# EAGLE schematic Nixie Clock v2 (EAGLE 9.6.2)
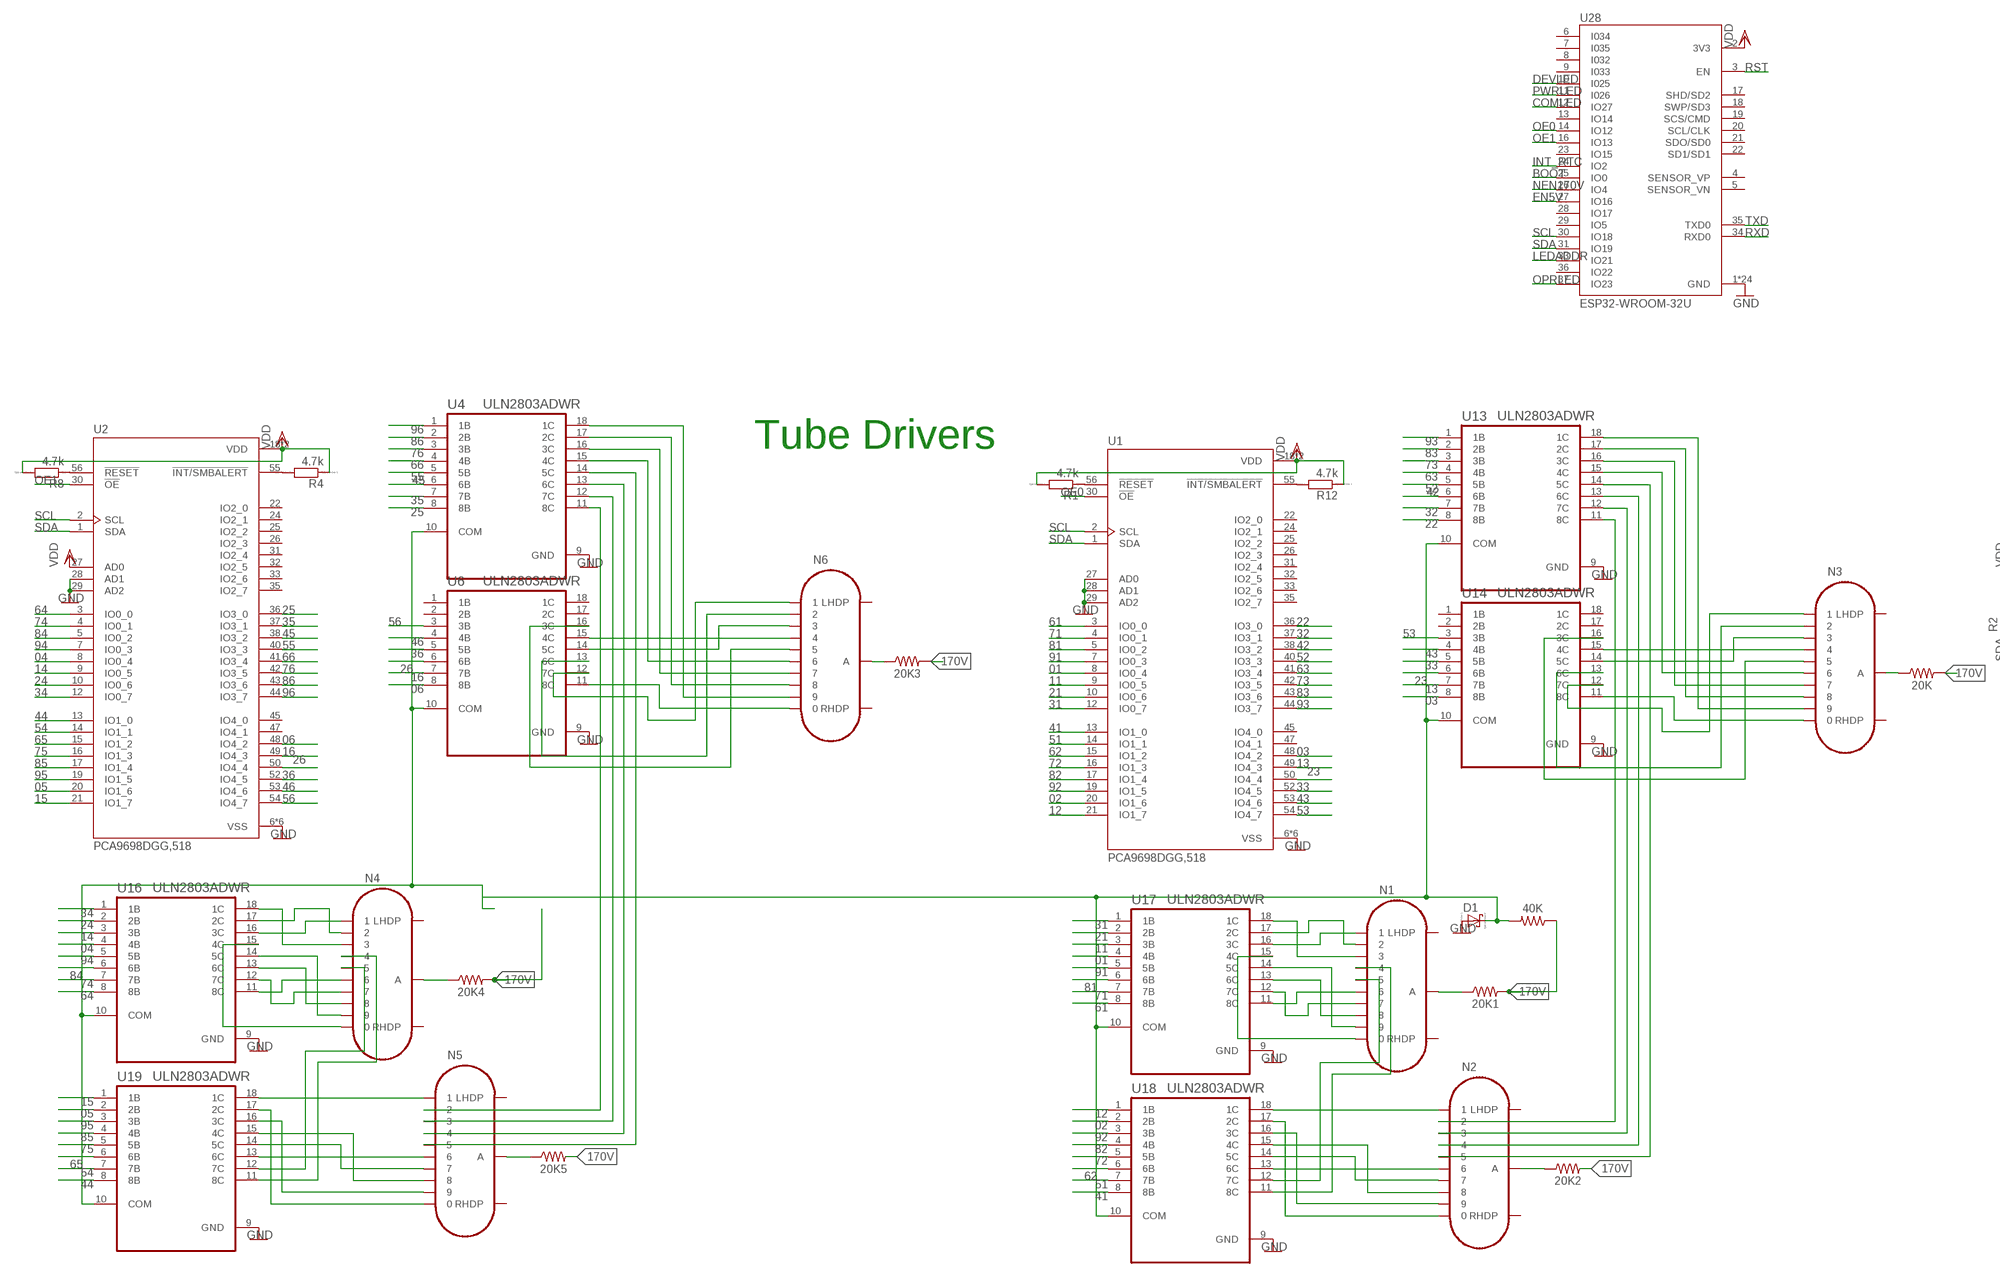
[diagram p0: schematic, sheet 1, part 1 of 2]
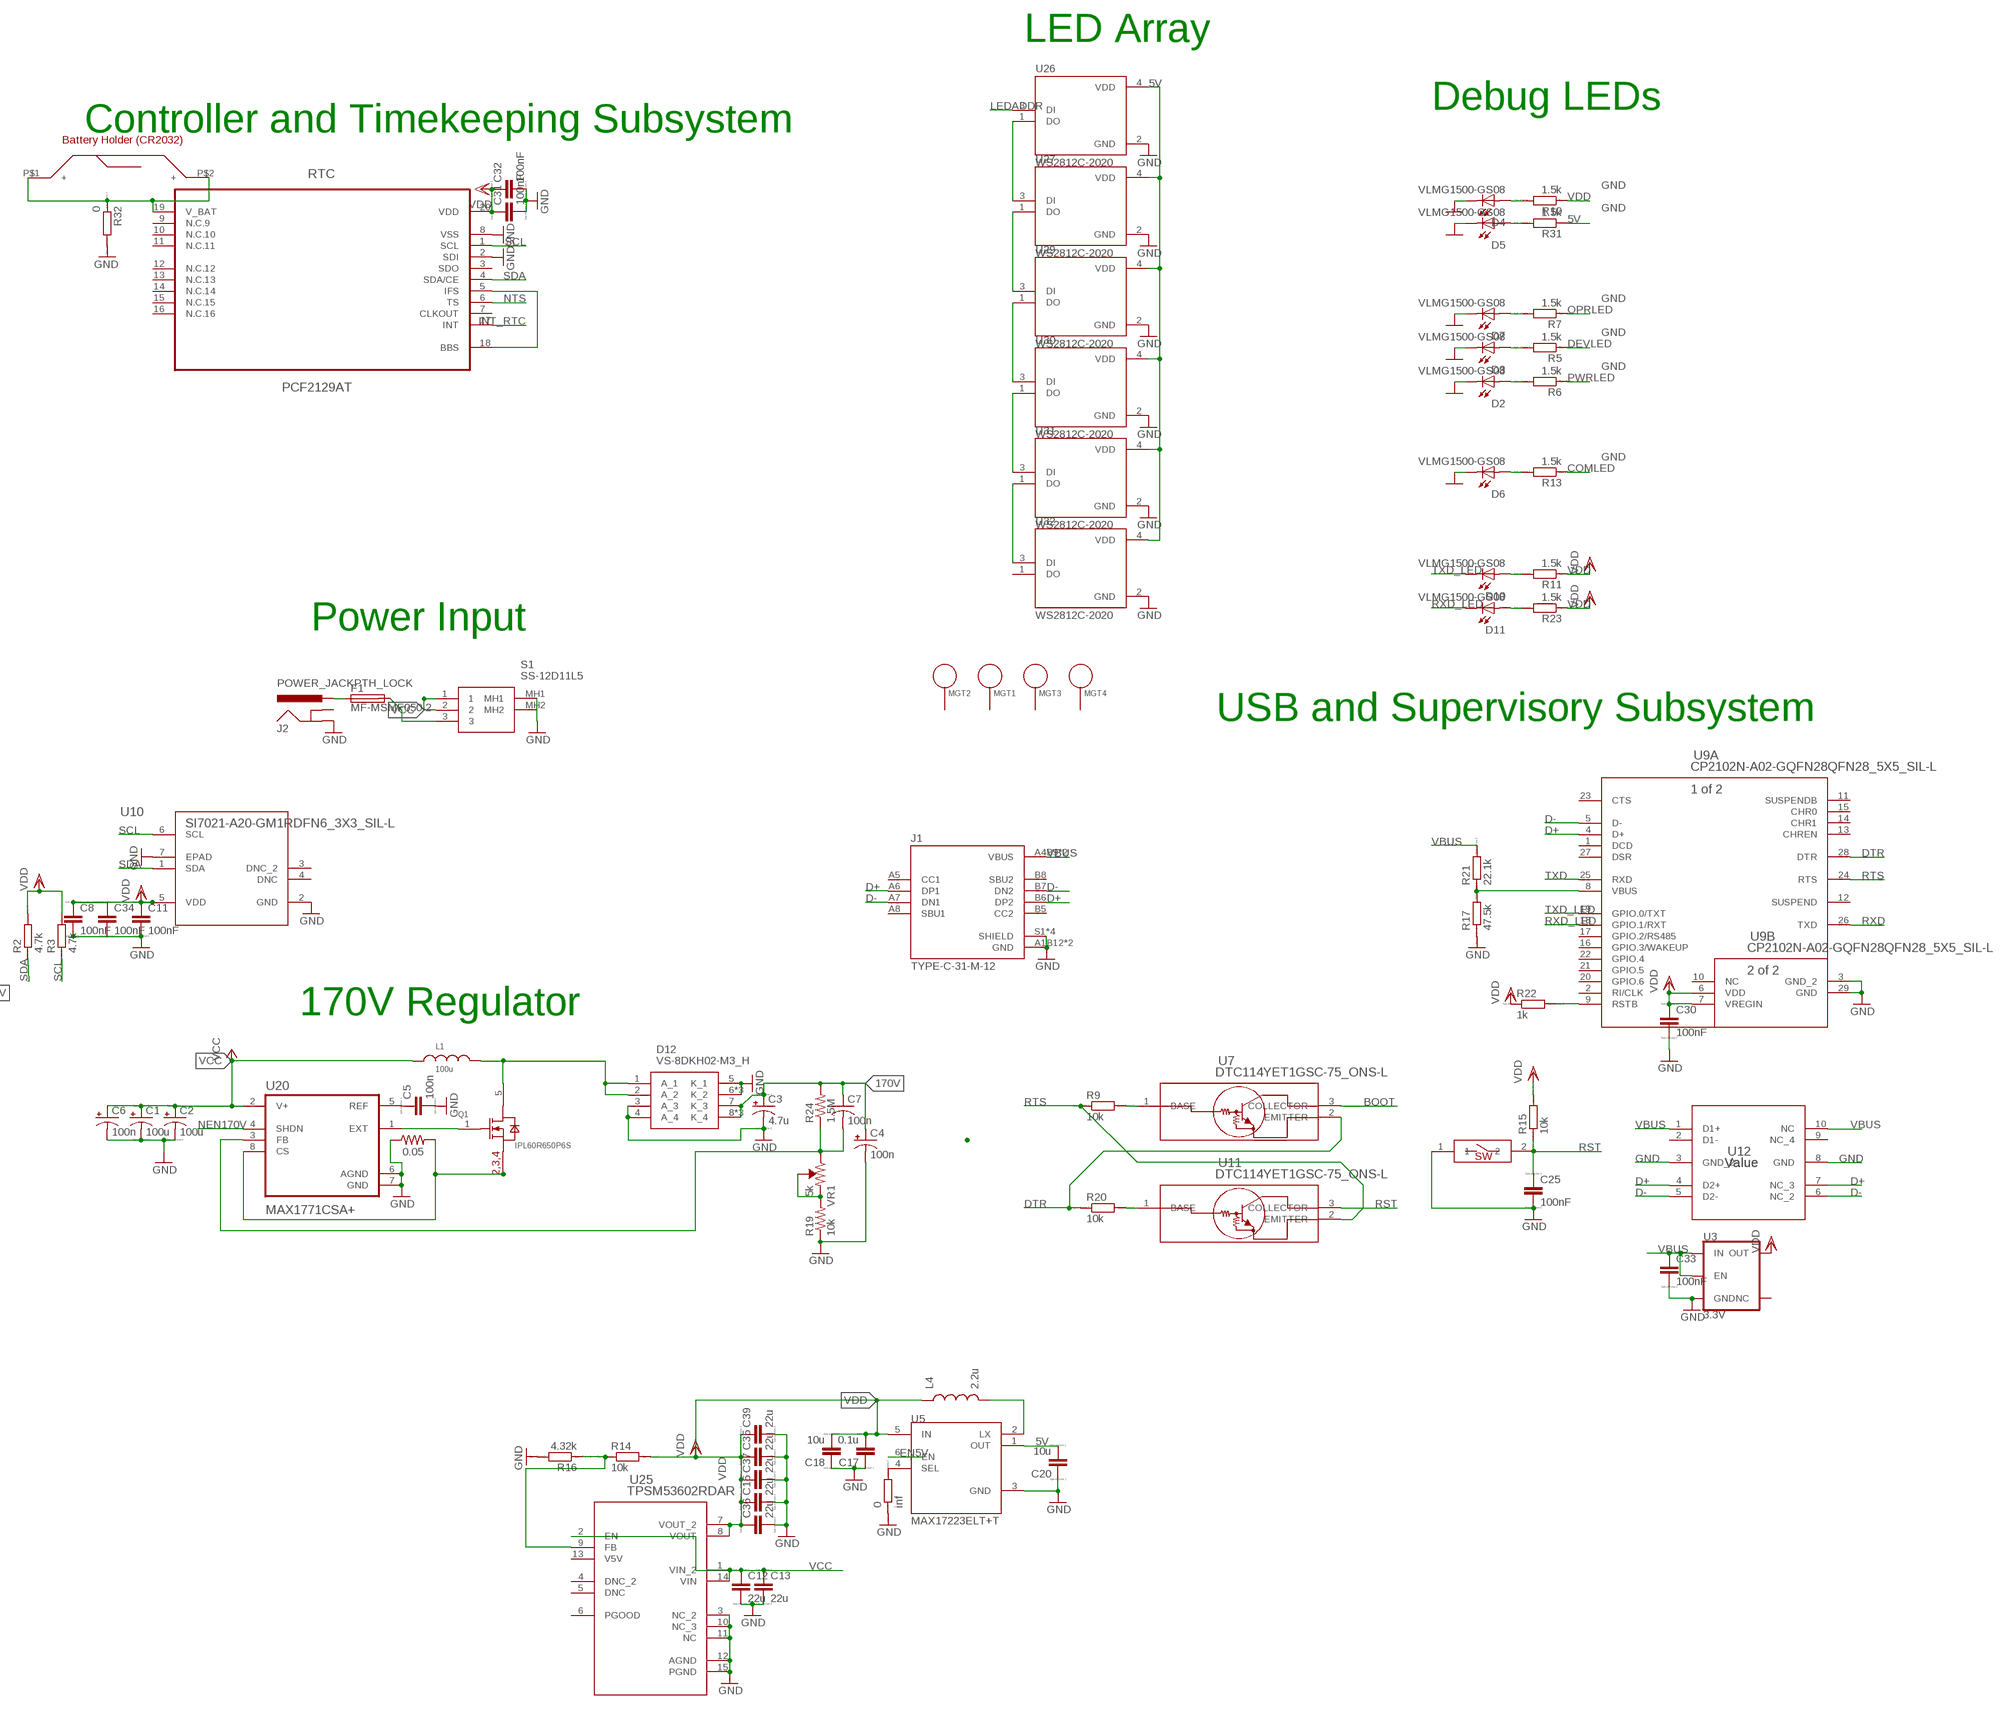
[diagram p1: schematic, sheet 1, part 2 of 2]

## Parts
0  inf  RR0402  [R0402]
0.05  0.05  0.1OHM-1210-1/2W-1%  [1210]
20K  0.05  0.1OHM-1210-1/2W-1%  [1210]
20K1  0.05  0.1OHM-1210-1/2W-1%  [1210]
20K2  0.05  0.1OHM-1210-1/2W-1%  [1210]
20K3  0.05  0.1OHM-1210-1/2W-1%  [1210]
20K4  0.05  0.1OHM-1210-1/2W-1%  [1210]
20K5  0.05  0.1OHM-1210-1/2W-1%  [1210]
40K  0.05  0.1OHM-1210-1/2W-1%  [1210]
C1  100u  CPOL-USE3.5-8  [E3,5-8]
C2  100u  CPOL-USE3.5-8  [E3,5-8]
C3  4.7u  CPOL-USE3.5-8  [E3,5-8]
C4  100n  CAPACITOR-PA/3216-18W  [A/3216-18W]
C5  100n  CC0402  [C0402]
C6  100n  CAPACITOR-PA/3216-18W  [A/3216-18W]
C7  100n  C-USC1206K  [C1206K]
C8  100nF  CC0402  [C0402]
C11  100nF  CC0402  [C0402]
C12  22u  CC0603R  [C0603R]
C13  22u  CC0603R  [C0603R]
C15  22u  CC0603R  [C0603R]
C17  0.1u  CC0402  [C0402]
C18  10u  CC0402  [C0402]
C20  10u  CC0402  [C0402]
C25  100nF  CC0402  [C0402]
C30  100nF  CC0402  [C0402]
C31  100nF  CC0402  [C0402]
C32  100nF  CC0402  [C0402]
C33  100nF  CC0402  [C0402]
C34  100nF  CC0402  [C0402]
C35  22u  CC0603R  [C0603R]
C36  22u  CC0603R  [C0603R]
C37  22u  CC0603R  [C0603R]
C39  22u  CC0603R  [C0603R]
D1  SCHOTTKY-DIODE  [DIODE_SMB]
D2  VLMG1500-GS08  [LEDC1005X35N]
D3  VLMG1500-GS08  [LEDC1005X35N]
D4  VLMG1500-GS08  [LEDC1005X35N]
D5  VLMG1500-GS08  [LEDC1005X35N]
D6  VLMG1500-GS08  [LEDC1005X35N]
D7  VLMG1500-GS08  [LEDC1005X35N]
D10  VLMG1500-GS08  [LEDC1005X35N]
D11  VLMG1500-GS08  [LEDC1005X35N]
D12  VS-8DKH02-M3_H  [VS8DKH02M3H]
F1  MF-MSMF050-2  [1812]
J1  TYPE-C-31-M-12  [HRO_TYPE-C-31-M-12]
J2  POWER_JACKPTH_LOCK  [POWER_JACK_PTH_LOCK]
L1  100u  WE-PD_1210_7447709001  [WE-PD_1260/1245/1280/1210]
L4  2.2u  INDUCTOR  [L0603]
MGT1  BEAGLEBONEBLACK_MOUNTING_HOLE  [BEAGLEBONEBLACK_MOUNTING_HOLE]
MGT2  BEAGLEBONEBLACK_MOUNTING_HOLE  [BEAGLEBONEBLACK_MOUNTING_HOLE]
MGT3  BEAGLEBONEBLACK_MOUNTING_HOLE  [BEAGLEBONEBLACK_MOUNTING_HOLE]
MGT4  BEAGLEBONEBLACK_MOUNTING_HOLE  [BEAGLEBONEBLACK_MOUNTING_HOLE]
N1  IN-14  [IN-14]
N2  IN-14  [IN-14]
N3  IN-14  [IN-14]
N4  IN-14  [IN-14]
N5  IN-14  [IN-14]
N6  IN-14  [IN-14]
Q1  IPL60R650P6S  [INF-PG-TSON-8-2]
R1  4.7k  RR0402  [R0402]
R2  4.7k  RR0402  [R0402]
R3  4.7k  RR0402  [R0402]
R4  4.7k  RR0402  [R0402]
R5  1.5k  RR0402  [R0402]
R6  1.5k  RR0402  [R0402]
R7  1.5k  RR0402  [R0402]
R8  4.7k  RR0402  [R0402]
R9  10k  RR0402  [R0402]
R10  1.5k  RR0402  [R0402]
R11  1.5k  RR0402  [R0402]
R12  4.7k  RR0402  [R0402]
R13  1.5k  RR0402  [R0402]
R14  10k  RR0402  [R0402]
R15  10k  RR0402  [R0402]
R16  4.32k  RR0402  [R0402]
R17  47.5k  RR0402  [R0402]
R19  10k  R-US_M1206  [M1206]
R20  10k  RR0402  [R0402]
R21  22.1k  RR0402  [R0402]
R22  1k  RR0402  [R0402]
R23  1.5k  RR0402  [R0402]
R24  1.5M  R-US_M1206  [M1206]
R31  1.5k  RR0402  [R0402]
R32  0  RR0402  [R0402]
RESET  SMDSWITCH  [RESC4217X170]
S1  SS-12D11L5  [SS12D11L5]
U1  PCA9698DGG,518  [SOP50P810X120-56N]
U2  PCA9698DGG,518  [SOP50P810X120-56N]
U3  3.3V  V_REG_AP2112K-3.3V  [SOT23-5]
U4  ULN2803ADWR  [SOIC127P1030X265-18N]
U5  MAX17223ELT+T  [PSON65P200X200X80-6N]
U6  ULN2803ADWR  [SOIC127P1030X265-18N]
U7  DTC114YET1GSC-75_ONS-L  [SC-75_ONS-L]
U9  CP2102N-A02-GQFN28QFN28_5X5_SIL-L  [QFN28_5X5_SIL-L]
U10  SI7021-A20-GM1RDFN6_3X3_SIL-L  [DFN6_3X3_SIL-L]
U11  DTC114YET1GSC-75_ONS-L  [SC-75_ONS-L]
U12  Value  ESD204DQAR  [DQA0010A]
U13  ULN2803ADWR  [SOIC127P1030X265-18N]
U14  ULN2803ADWR  [SOIC127P1030X265-18N]
U16  ULN2803ADWR  [SOIC127P1030X265-18N]
U17  ULN2803ADWR  [SOIC127P1030X265-18N]
U18  ULN2803ADWR  [SOIC127P1030X265-18N]
U19  ULN2803ADWR  [SOIC127P1030X265-18N]
U20  MAX1771CSA+  [SOIC127P600X175-8N]
U25  TPSM53602RDAR  [B3QFN15_RDA_TEX]
U26  WS2812C-2020  [LED_WS2812C-2020]
U27  WS2812C-2020  [LED_WS2812C-2020]
U28  ESP32-WROOM-32U  [XCVR_ESP32-WROOM-32U]
U29  WS2812C-2020  [LED_WS2812C-2020]
U30  WS2812C-2020  [LED_WS2812C-2020]
U31  WS2812C-2020  [LED_WS2812C-2020]
U32  WS2812C-2020  [LED_WS2812C-2020]
U$1  PCF2129AT  [PCF2129AT]
U$2  HOLDER  [HOLDER]
VR1  5k  TRIMPOT-SMD-3MM-CLOSED-1/8W-20%  [TRIMPOT-SMD-3MM-CLOSED]

## Nets
01: U1.8(IO0_4) U17.4(4B)
02: U1.20(IO1_6) U18.2(2B)
03: U1.48(IO4_2) U14.8(8B)
04: U2.8(IO0_4) U16.4(4B)
05: U2.20(IO1_6) U19.2(2B)
5V: C20.2 R31.1 U5.1(OUT) U26.4(VDD) U27.4(VDD) U29.4(VDD) U30.4(VDD) U31.4(VDD) U32.4(VDD)
06: U2.48(IO4_2) U6.8(8B)
11: U1.9(IO0_5) U17.3(3B)
12: U1.21(IO1_7) U18.1(1B)
13: U1.49(IO4_3) U14.7(7B)
14: U2.9(IO0_5) U16.3(3B)
15: U2.21(IO1_7) U19.1(1B)
16: U2.49(IO4_3) U6.7(7B)
21: U1.10(IO0_6) U17.2(2B)
22: U1.36(IO3_0) U13.8(8B)
23: U1.50(IO4_4) U14.6(6B)
24: U2.10(IO0_6) U16.2(2B)
25: U2.36(IO3_0) U4.8(8B)
26: U2.50(IO4_4) U6.6(6B)
31: U1.12(IO0_7) U17.1(1B)
32: U1.37(IO3_1) U13.7(7B)
33: U1.52(IO4_5) U14.5(5B)
34: U2.12(IO0_7) U16.1(1B)
35: U2.37(IO3_1) U4.7(7B)
36: U2.52(IO4_5) U6.5(5B)
41: U1.13(IO1_0) U18.8(8B)
42: U1.38(IO3_2) U13.6(6B)
43: U1.53(IO4_6) U14.4(4B)
44: U2.13(IO1_0) U19.8(8B)
45: U2.38(IO3_2) U4.6(6B)
46: U2.53(IO4_6) U6.4(4B)
51: U1.14(IO1_1) U18.7(7B)
52: U1.40(IO3_3) U13.5(5B)
53: U1.54(IO4_7) U14.3(3B)
54: U2.14(IO1_1) U19.7(7B)
55: U2.40(IO3_3) U4.5(5B)
56: U2.54(IO4_7) U6.3(3B)
61: U1.3(IO0_0) U17.8(8B)
62: U1.15(IO1_2) U18.6(6B)
63: U1.41(IO3_4) U13.4(4B)
64: U2.3(IO0_0) U16.8(8B)
65: U2.15(IO1_2) U19.6(6B)
66: U2.41(IO3_4) U4.4(4B)
71: U1.4(IO0_1) U17.7(7B)
72: U1.16(IO1_3) U18.5(5B)
73: U1.42(IO3_5) U13.3(3B)
74: U2.4(IO0_1) U16.7(7B)
75: U2.16(IO1_3) U19.5(5B)
76: U2.42(IO3_5) U4.3(3B)
81: U1.5(IO0_2) U17.6(6B)
82: U1.17(IO1_4) U18.4(4B)
83: U1.43(IO3_6) U13.2(2B)
84: U2.5(IO0_2) U16.6(6B)
85: U2.17(IO1_4) U19.4(4B)
86: U2.43(IO3_6) U4.2(2B)
91: U1.7(IO0_3) U17.5(5B)
92: U1.19(IO1_5) U18.3(3B)
93: U1.44(IO3_7) U13.1(1B)
94: U2.7(IO0_3) U16.5(5B)
95: U2.19(IO1_5) U19.3(3B)
96: U2.44(IO3_7) U4.1(1B)
170V [HV]: 20K1.2 20K2.2 20K3.2 20K4.2 20K5.2 20K.2 40K.1 C3.+ C4.+ C7.1 D12.7(K_3) D12.8(K_4) D12.9(K_4) D12.12(K_4) R24.2
BOOT: U7.3(COLLECTOR) U28.25(IO0)
COMLED: R13.1 U28.12(IO27)
D+: J1.A6(DP1) J1.B6(DP2) U9.4(A:D+) U12.4(D2+) U12.7(NC_3)
D-: J1.A7(DN1) J1.B7(DN2) U9.5(A:D-) U12.5(D2-) U12.6(NC_2)
DEVLED: R5.1 U28.10(I025)
DTR: R20.1 U7.2(EMITTER) U9.28(A:DTR)
EN5V: U5.6(EN) U28.27(IO16)
GND: 0.1 0.05.1 C1.- C2.- C3.- C4.- C5.2 C6.- C8.2 C11.2 C12.2 C13.2 C15.2 C17.1 C18.1 C20.1 C25.2 C30.2 C31.2 C32.2 C33.2 C34.2 C35.2 C36.2 C37.2 C39.2 D1.A(C) D2.2 D3.2 D4.2 D5.2 D6.2 D7.2 D12.3(A_3) D12.4(A_4) D12.5(K_1) D12.6(K_2) D12.10(K_2) D12.11(K_2) J1.A1B12(GND) J1.B1A12(GND) J1.S1(SHIELD) J1.S2(SHIELD) J1.S3(SHIELD) J1.S4(SHIELD) J2.GND R16.2 R17.1 R19.1 R32.2 RESET.1 S1.MH1 S1.MH2 U1.6(VSS) U1.11(VSS) U1.23(VSS) U1.27(AD0) U1.28(AD1) U1.29(AD2) U1.34(VSS) U1.39(VSS) U1.51(VSS) U2.6(VSS) U2.11(VSS) U2.23(VSS) U2.28(AD1) U2.29(AD2) U2.34(VSS) U2.39(VSS) U2.51(VSS) U3.2(GND) U4.9(GND) U5.3(GND) U6.9(GND) U9.3(B:GND_2) U9.29(B:GND) U10.2(GND) U10.7(EPAD) U12.3(GND_2) U12.8(GND) U13.9(GND) U14.9(GND) U16.9(GND) U17.9(GND) U18.9(GND) U19.9(GND) U20.6(AGND) U20.7(GND) U25.3(NC_2) U25.10(NC_3) U25.11(NC) U25.12(AGND) U25.15(PGND) U26.2(GND) U27.2(GND) U28.1(GND) U28.15(GND) U28.38(GND) U28.G.1(GND) U28.G.2(GND) U28.G.4(GND) U28.G.5(GND) U28.G.6(GND) U28.G.7(GND) U28.G.8(GND) U28.G.9(GND) U28.G.10(GND) U28.G.11(GND) U28.G.12(GND) U28.G.13(GND) U28.G.14(GND) U28.G.15(GND) U28.G.16(GND) U28.G.17(GND) U28.G.18(GND) U28.G.19(GND) U28.G.20(GND) U28.G.21(GND) U28.G.22(GND) U29.2(GND) U30.2(GND) U31.2(GND) U32.2(GND) U$1.2(SDI) U$1.8(VSS)
INT_RTC: U28.24(IO2) U$1.17(INT)
LEDADDR: U26.3(DI) U28.33(IO21)
N$1: F1.1 J2.PWR
N$2: C5.1 U20.5(REF)
N$3: 20K1.1 N1.A
N$4: Q1.1(GATE) U20.1(EXT)
N$5: 0.05.2 Q1.2(SOURCE) Q1.3(SOURCE) Q1.4(SOURCE) U20.8(CS)
N$6: D12.1(A_1) D12.2(A_2) L1.2 Q1.5(DRAIN)
N$7 [HV]: N2.0 U18.17(2C)
N$8 [HV]: N2.9 U18.16(3C)
N$9: 20K2.1 N2.A
N$10: R19.2 VR1.1(CCW) VR1.2(WIPER)
N$11: C7.2 R24.1 U20.3(FB) VR1.3(CW)
N$12 [HV]: N2.8 U18.15(4C)
N$13 [HV]: N2.7 U18.14(5C)
N$14 [HV]: N1.5 U18.12(7C)
N$15: 20K.1 N3.A
N$16 [HV]: N2.6 U18.13(6C)
N$17: 0.2 U5.4(SEL)
N$18: D3.1 R5.2
N$19: D7.1 R7.2
N$20: L4.2 U5.2(LX)
N$21: 20K4.1 N4.A
N$22 [HV]: N2.1 U18.18(1C)
N$23: R17.2 R21.1 U9.8(A:VBUS)
N$24: D2.1 R6.2
N$25: D4.1 R10.2
N$26: D5.1 R31.2
N$27: D6.1 R13.2
N$28 [HV]: N2.2 U13.11(8C)
N$29: R20.2 U11.1(BASE)
N$30: R9.2 U7.1(BASE)
N$32 [HV]: N1.6 U17.11(8C)
N$33 [HV]: N1.7 U17.12(7C)
N$35: R22.2 U9.9(A:RSTB)
N$36: D10.1 R11.2
N$37: D11.1 R23.2
N$38: F1.2 S1.3
N$39 [HV]: N1.8 U17.13(6C)
N$40 [HV]: N1.9 U17.14(5C)
N$41 [HV]: N1.0 U17.15(4C)
N$42 [HV]: N1.1 U17.16(3C)
N$43 [HV]: N1.2 U17.17(2C)
N$44 [HV]: N1.3 U17.18(1C)
N$45 [HV]: N2.3 U13.12(7C)
N$46 [HV]: N1.4 U18.11(8C)
N$47 [HV]: N2.4 U13.13(6C)
N$48 [HV]: N2.5 U13.14(5C)
N$49 [HV]: N3.6 U13.15(4C)
N$50 [HV]: N3.7 U13.16(3C)
N$51 [HV]: N3.8 U13.17(2C)
N$52 [HV]: N3.9 U13.18(1C)
N$53 [HV]: N3.0 U14.11(8C)
N$54 [HV]: N3.1 U14.12(7C)
N$55 [HV]: N3.2 U14.13(6C)
N$56 [HV]: N3.3 U14.14(5C)
N$57 [HV]: N3.4 U14.15(4C)
N$58 [HV]: N3.5 U14.16(3C)
N$59: R4.2 U2.55(!INT/SMBALERT)
N$60 [HV]: N4.6 U16.11(8C)
N$61 [HV]: N4.7 U16.12(7C)
N$62 [HV]: N4.8 U16.13(6C)
N$63 [HV]: N4.9 U16.14(5C)
N$64 [HV]: N4.0 U16.15(4C)
N$65 [HV]: N4.1 U16.16(3C)
N$66 [HV]: N4.2 U16.17(2C)
N$67 [HV]: 40K.2 D1.C(A) U4.10(COM) U6.10(COM) U13.10(COM) U14.10(COM) U16.10(COM) U17.10(COM) U18.10(COM) U19.10(COM)
N$68 [HV]: N4.3 U16.18(1C)
N$69 [HV]: N4.4 U19.11(8C)
N$70 [HV]: N4.5 U19.12(7C)
N$71 [HV]: N5.0 U19.17(2C)
N$72 [HV]: N5.9 U19.16(3C)
N$73 [HV]: N5.8 U19.15(4C)
N$74 [HV]: N5.7 U19.14(5C)
N$75 [HV]: N5.6 U19.13(6C)
N$76 [HV]: N5.1 U19.18(1C)
N$77 [HV]: N5.2 U4.11(8C)
N$78 [HV]: N5.3 U4.12(7C)
N$79 [HV]: N5.4 U4.13(6C)
N$80 [HV]: N5.5 U4.14(5C)
N$81 [HV]: N6.6 U4.15(4C)
N$82 [HV]: N6.7 U4.16(3C)
N$83 [HV]: N6.8 U4.17(2C)
N$84 [HV]: N6.9 U4.18(1C)
N$85 [HV]: N6.0 U6.11(8C)
N$86 [HV]: N6.1 U6.12(7C)
N$87 [HV]: N6.2 U6.13(6C)
N$88 [HV]: N6.3 U6.14(5C)
N$89 [HV]: N6.4 U6.15(4C)
N$90 [HV]: N6.5 U6.16(3C)
N$91: R14.1 R16.1 U25.9(FB)
N$92: 20K5.1 N5.A
N$93: 20K3.1 N6.A
N$94: R1.1 U1.56(!RESET)
N$95: R12.2 U1.55(!INT/SMBALERT)
N$96: R32.1 U$1.19(V_BAT) U$2.P$1(+) U$2.P$2(+)
N$97: R8.1 U2.56(!RESET)
N$100: U26.1(DO) U27.3(DI)
N$101: U27.1(DO) U29.3(DI)
N$102: U29.1(DO) U30.3(DI)
N$103: U30.1(DO) U31.3(DI)
N$104: U31.1(DO) U32.3(DI)
N$199: U$1.5(IFS) U$1.18(BBS)
NEN170V: U20.4(SHDN) U28.26(IO4)
NTS: U$1.6(TS)
OE0: U1.30(!OE) U28.14(IO12)
OE1: U2.30(!OE) U28.16(IO13)
OPRLED: R7.1 U28.37(IO23)
PWRLED: R6.1 U28.11(I026)
RST: C25.1 R15.1 RESET.2 U11.3(COLLECTOR) U28.3(EN)
RTS: R9.1 U9.24(A:RTS) U11.2(EMITTER)
RXD: U9.26(A:TXD) U28.34(RXD0)
RXD_LED: D11.2 U9.18(A:GPIO.1/RXT)
SCL: R3.1 U1.2(SCL) U2.2(SCL) U10.6(SCL) U28.30(IO18) U$1.1(SCL)
SDA: R2.1 U1.1(SDA) U2.1(SDA) U10.1(SDA) U28.31(IO19) U$1.4(SDA/CE)
TXD: U9.25(A:RXD) U28.35(TXD0)
TXD_LED: D10.2 U9.19(A:GPIO.0/TXT)
VBUS: C33.1 J1.A4B9(VBUS) J1.B4A9(VBUS) R21.2 U3.1(IN) U3.3(EN) U12.1(D1+) U12.10(NC)
VCC: C1.+ C2.+ C6.+ C12.1 C13.1 L1.1 S1.1 S1.2 U20.2(V+) U25.1(VIN_2) U25.2(EN) U25.14(VIN)
VDD: C8.1 C11.1 C15.1 C17.2 C18.2 C30.1 C31.1 C32.1 C34.1 C35.1 C36.1 C37.1 C39.1 L4.1 R1.2 R2.2 R3.2 R4.1 R8.2 R10.1 R11.1 R12.1 R14.2 R15.2 R22.1 R23.1 U1.18(VDD) U1.46(VDD) U2.18(VDD) U2.27(AD0) U2.46(VDD) U3.5(OUT) U5.5(IN) U9.6(B:VDD) U9.7(B:VREGIN) U10.5(VDD) U25.7(VOUT_2) U25.8(VOUT) U28.2(3V3) U$1.20(VDD)
Unconnected: J1.A5(CC1) J1.A8(SBU1) J1.B5(CC2) J1.B8(SBU2) J2.GNDBREAK MGT1.P$1 MGT2.P$1 MGT3.P$1 MGT4.P$1 N1.LHDP N1.RHDP N2.LHDP N2.RHDP N3.LHDP N3.RHDP N4.LHDP N4.RHDP N5.LHDP N5.RHDP N6.LHDP N6.RHDP U1.22(IO2_0) U1.24(IO2_1) U1.25(IO2_2) U1.26(IO2_3) U1.31(IO2_4) U1.32(IO2_5) U1.33(IO2_6) U1.35(IO2_7) U1.45(IO4_0) U1.47(IO4_1) U2.22(IO2_0) U2.24(IO2_1) U2.25(IO2_2) U2.26(IO2_3) U2.31(IO2_4) U2.32(IO2_5) U2.33(IO2_6) U2.35(IO2_7) U2.45(IO4_0) U2.47(IO4_1) U3.4(NC) U6.1(1B) U6.2(2B) U6.17(2C) U6.18(1C) U9.1(A:DCD) U9.2(A:RI/CLK) U9.10(B:NC) U9.11(A:SUSPENDB) U9.12(A:SUSPEND) U9.13(A:CHREN) U9.14(A:CHR1) U9.15(A:CHR0) U9.16(A:GPIO.3/WAKEUP) U9.17(A:GPIO.2/RS485) U9.20(A:GPIO.6) U9.21(A:GPIO.5) U9.22(A:GPIO.4) U9.23(A:CTS) U9.27(A:DSR) U10.3(DNC_2) U10.4(DNC) U12.2(D1-) U12.9(NC_4) U14.1(1B) U14.2(2B) U14.17(2C) U14.18(1C) U25.4(DNC_2) U25.5(DNC) U25.6(PGOOD) U25.13(V5V) U28.4(SENSOR_VP) U28.5(SENSOR_VN) U28.6(I034) U28.7(I035) U28.8(I032) U28.9(I033) U28.13(IO14) U28.17(SHD/SD2) U28.18(SWP/SD3) U28.19(SCS/CMD) U28.20(SCL/CLK) U28.21(SDO/SD0) U28.22(SD1/SD1) U28.23(IO15) U28.28(IO17) U28.29(IO5) U28.36(IO22) U32.1(DO) U$1.3(SDO) U$1.7(CLKOUT) U$1.9(N.C.9) U$1.10(N.C.10) U$1.11(N.C.11) U$1.12(N.C.12) U$1.13(N.C.13) U$1.14(N.C.14) U$1.15(N.C.15) U$1.16(N.C.16)

## Notes on the sheet
- LED Array
- Debug LEDs
- Controller and Timekeeping Subsystem
- Power Input
- USB and Supervisory Subsystem
- Tube Drivers
- 170V Regulator

## Library data of the parts
0 R1-R17 R20-R23 R31 R32 = eagle-ltspice:R: RESISTOR, European symbol; SPICEMODEL: NONE; SPICEPREFIX: R
0.05 20K 20K1-20K5 40K = SparkFun-Resistors:0.1OHM: 0.1Ω resistor A resistor is a passive two-terminal electrical component that implements electrical resistance as a circuit element. Resistors act to reduce current flow, and, at the same time, act to lower voltage levels within circuits. - Wikipedia; PROD_ID: RES-12374; VALUE: 0.1
C1-C3 = resistor:CPOL-US: POLARIZED CAPACITOR, American symbol
C4 C6 = BeagleBone_Blue_R3:CAPACITOR-P: POLARIZED CAPACITOR, American symbol
C5 C8 C11 C17 C18 C20 C25 C30-C34 = eagle-ltspice:C: CAPACITOR, European symbol; SPICEMODEL: NONE; SPICEPREFIX: C
C7 = resistor:C-US: CAPACITOR, American symbol
C12 C13 C15 C35-C37 C39 = eagle-ltspice:C: CAPACITOR, European symbol
D1 = eagle-ltspice:SCHOTTKY-DIODE: Schottky Diode; SPICEMODEL: NONE; SPICEPREFIX: D; SPICETYPE: diode
D2-D7 D10 D11 = VLMG1500-GS08:VLMG1500-GS08: 0402 GREEN 571nm 35MCD 65° Rectangle with Flat Top SMT LED; AVAILABILITY: Unavailable; DESCRIPTION: 0402 GREEN 571nm 35MCD 65° Rectangle with Flat Top SMT LED; MF: Vishay; MP: VLMG1500-GS08; PACKAGE: 0402 Vishay; PRICE: None
D12 = VS-8DKH02-M3_H:VS-8DKH02-M3_H: RECT 8A 0.7V FRED PT FLATPAK 5X6 Source: Datasheet <http://www.vishay.com/docs/96090/vs-8dkh02-m3.pdf>; ARROW_PART_NUMBER: VS-8DKH02-M3/H; ARROW_PRICE-STOCK: https://www.arrow.com/en/products/vs-8dkh02-m3h/vishay; DESCRIPTION: RECT 8A 0.7V FRED PT FLATPAK 5X6; HEIGHT: mm; MANUFACTURER_NAME: Vishay; MANUFACTURER_PART_NUMBER: VS-8DKH02-M3/H; MOUSER_PART_NUMBER: 78-VS-8DKH02-M3/H; MOUSER_PRICE-STOCK: https://www.mouser.co.uk/ProductDetail/Vishay-Semiconductors/VS-8DKH02-M3-H?qs=F5EMLAvA7IDu9VvD%2F8cT5Q%3D%3D
F1 = Thermistor_Inductors:MF-MSMF050-2: PTC RESET FUSE 15V 500MA 1812 Manufacturer's datasheet <https://www.bourns.com/docs/Product-Datasheets/mfmsmf.pdf>; CREATED_BY: PCBLayout.com; DIGIKEY_PART_NUMBER: MF-MSMF050-2TR-ND; MANUFACTURER: Bourns Inc.; MPN: MF-MSMF050-2; PACKAGE: 1812
J1 = TYPE-C-31-M-12:TYPE-C-31-M-12: USB Connectors 24 Receptacle 1 8.94*7.3mm RoHS Check prices <https://pricing.snapeda.com/parts/TYPE-C-31-M-12/HRO%20Electronics%20Co.%2C%20Ltd./view-part?ref=eda>; AVAILABILITY: Not in stock; DESCRIPTION: USB Connectors 24 Receptacle 1 8.94*7.3mm RoHS; MF: HRO Electronics Co., Ltd.; MP: TYPE-C-31-M-12; PACKAGE: Package; PRICE: None
J2 = SparkFun-Connectors:POWER_JACK: Power Jack Connector This is the standard 5.5mm barrel jack for power. The PTH is the most common, proven, reliable, footprint. The Slot footprint only works if the mill layer is transmitted to the PCB fab house so be warned. Here are the connectors we sell at SparkFun: DC Barrel Power Jack/Connector <https://www.sparkfun.com/products/119> (PRT-00119) DC Barrel Power Jack/Connector (SMD) <https://www.sparkfun.com/products/12748> (PRT-12748) DC Barrel Jack Adapter - Breadboard Compatible <https://www.sparkfun.com/products/10811> (PRT-10811) It is used on this SparkFun product (and many, many others): SparkFun RedBoard - Programmed with Arduino <https://www.sparkfun.com/products/12757> (DEV-12757) Also, if you need a mating power supply or connector, please check these out: Wall Adapter Power Supply - 9VDC 650mA <https://www.sparkfun.com/products/298> (TOL-00298) DC Barrel Jack Adapter - Male <https://www.sparkfun.com/products/10287> (PRT-10287); PROD_ID: CONN-08197; SF_ID: PRT-00119
L1 = Wurth_Elektronik_Passive_rev18f:WE-PD_1210: SMD Shielded Power Inductor Characteristics Magnetically shielded version which results in a low leakage field High Saturation currents up to 25 A Very low self-losses at high switching frequency‘s Wide inductances spectrum available at all sizes Operating temperature: –40 °C to +125 °C Applications Perfectly suitable for switching regulators with extremely high efficiency Integrated DC/DC- converter Switching regulators with low operating voltages (Graphic cards, embedded PC-Cards, Mainboards) Plastic base: Because of the one piece construction these are more suitable for high vibration or shock applications <http://katalog.we-online.de/media/images/v2/Family_WE-PD.jpg> Details see: http://katalog.we-online.de/en/pbs/WE-PD? Updated by Dan Xu 2014-07-08 2014 (C) Wurth Elektronik; WE-NUMBER: 7447709001/1uH
L4 = BeagleBone_Blue_R3:INDUCTOR: Inductors Basic Inductor/Choke - 0603 and 1206. Footprints are not proven and vary greatly between part numbers. SRN6045- 33uH, 20% 1.4A
MGT1-MGT4 = BeagleBone_Black_Wireless:BEAGLEBONEBLACK_MOUNTING_HOLE: Chassis Mounting Hole w/GND connection ability
N1-N6 = russian-nixies:IN-14: IN-14: medium numeric frontview nixie tube
Q1 = IPL60R650P6S:IPL60R650P6S: IPL60R650P6S 600V CoolMOS C6 Power Transistor, RDS 0.65Ohm, ID 16.5A INF-PG-TSON-8-2
R19 R24 = resistor:R-US_: RESISTOR, American symbol
RESET = SMD SWITCH:SMDSWITCH
S1 = SS-12D11L5:SS-12D11L5: Toggle Switches DIP RoHS Source: Datasheet <https://datasheet.lcsc.com/szlcsc/XKB-SS-12D11L5_C319010.pdf>; ARROW_PART_NUMBER: SS-12D11L5; DESCRIPTION: Toggle Switches DIP RoHS; HEIGHT: 6.9mm; MANUFACTURER_NAME: XKB Enterprise; MANUFACTURER_PART_NUMBER: SS-12D11L5
U1 U2 = PCA9698DGG_518:PCA9698DGG,518: PCA9698 - 40-bit Fm+ I2C-bus advanced I/O port with RESET, OE and INT Check prices <https://pricing.snapeda.com/parts/PCA9698DGG%2C518/NXP%20USA/view-part?ref=eda>; AVAILABILITY: Warning; DESCRIPTION: I/O Expander 40 I²C 1MHz 56-TSSOP; MF: NXP USA; MP: PCA9698DGG,518; PACKAGE: TSSOP-56 NXP Semiconductors; PRICE: None; PURCHASE-URL: https://pricing.snapeda.com/search/part/PCA9698DGG,518/?ref=eda
U3 = SparkFun-IC-Power:V_REG_AP2112: AP2112 - 600mA CMOS LDO Regulator w/ Enable The AP2112 is CMOS process low dropout linear regulator with enable function, the regulator delivers a guaranteed 600mA (min.) continuous load current. Features Output Voltage Accuracy: ±1.5% Output Current: 600mA (Min.) Foldback Short Current Protection: 50mA Enable Function to Turn ON/OFF VOUT Low Dropout Voltage (3.3V): 250mV (Typ.) @IOUT=600mA Excellent Load Regulation: 0.2%/A (Typ.) Excellent Line Regulation: 0.02%/V (Typ.) Low Quiescent Current: 55μA (Typ.) Low Standby Current: 0.01μA (Typ.) Low Output Noise: 50μVRMS PSRR: 100Hz -65dB, 1kHz -65dB OTSD Protection Stable with 1.0μF Flexible Cap: Ceramic, Tantalum and Aluminum Electrolytic Operation Temperature Range: -40°C to 85°C ESD: MM 400V, HBM 4000V; PROD_ID: VREG-12457
U4 U6 U13 U14 U16-U19 = ULN2803ADWR:ULN2803ADWR: Check prices <https://pricing.snapeda.com/parts/ULN2803ADWR/Texas%20Instruments/view-part?ref=eda>; AVAILABILITY: Warning; DESCRIPTION: 50-V, 8-ch darlington array 18-SOIC -40 to 85; MF: Texas Instruments; MP: ULN2803ADWR; PACKAGE: SOIC-18 Texas Instruments; PRICE: None; PURCHASE-URL: https://pricing.snapeda.com/search/part/ULN2803ADWR/?ref=eda
U5 = MAX17223ELT_T:MAX17223ELT+T: Conv DC-DC Single Step Up 0.4V to 5.5V 6-Pin uDFN T/R Check prices <https://pricing.snapeda.com/parts/MAX17223ELT%2B/Maxim%20Integrated/view-part?ref=eda>; AVAILABILITY: Bad; DESCRIPTION: Boost Switching Regulator IC Positive Adjustable 1.8V 1 Output 500mA (Switch) 6-WDFN; MF: Maxim Integrated; MP: MAX17223ELT+; PACKAGE: uDFN-6 Maxim; PRICE: None
U7 U11 = DTC114YET1G:DTC114YET1G; BUILT_BY: EMA_Justin; COPYRIGHT: Copyright (C) 2018 Accelerated Designs. All rights reserved; DATASHEET: https://www.onsemi.com/pub/Collateral/DTC114Y-D.PDF; MANUFACTURER_PART_NUMBER: DTC114YET1G; SOURCELIBRARY: ON_Semiconductor_2020-01-13; VENDOR: ON Semiconductor
U9 = CP2102N:CP2102N-A02-GQFN28; BUILT_BY: EMA_Cory; COPYRIGHT: Copyright (C) 2018 Accelerated Designs. All rights reserved; DATASHEET: https://www.silabs.com/documents/public/data-sheets/cp2102n-datasheet.pdf; MANUFACTURER_PART_NUMBER: CP2102N-A02-GQFN28; SOURCELIBRARY: Silicon_Labs_2020-02-14; VENDOR: Silicon Labs
U10 = SI7021:SI7021-A20-GM1R; BUILT_BY: EMA_Jessica; COPYRIGHT: Copyright (C) 2018 Accelerated Designs. All rights reserved; MANUFACTURER_PART_NUMBER: SI7021-A20-GM1R; SOURCELIBRARY: Silicon_Labs_2020-01-01; VENDOR: Silicon Labs
U12 = ESD204DQAR:ESD204DQAR; MANUFACTURER: Texas Instruments; PARTNUMBER: ESD204DQAR; REFDES: RefDes; TYPE: TYPE
U20 = MAX1771CSA:MAX1771CSA+: None; AVAILABILITY: Unavailable; DESCRIPTION: Boost, Buck-Boost Regulator Positive Output Step-Up, Step-Up/Step-Down DC-DC Controller IC 8-SOIC; MF: Maxim Integrated; MP: MAX1771CSA+; PACKAGE: SOIC-8 Maxim; PRICE: None
U25 = TPSM53602:TPSM53602RDAR; BUILT_BY: EMA_Cory; COPYRIGHT: Copyright (C) 2018 Accelerated Designs. All rights reserved; DATASHEET: https://www.ti.com/lit/ds/symlink/tpsm53602.pdf?ts=1593032137197&ref_url=https%253A%252F%252Fwww.ti.com%252Fstore%252Fti%252Fen%252Fp%252Fproduct%252F%253Fp%253DTPSM53602RDAR; MANUFACTURER_PART_NUMBER: TPSM53602RDAR; SOURCELIBRARY: TI_2020-06-27; VENDOR: Texas Instruments
U26 U27 U29-U32 = WS2812C-2020:WS2812C-2020: Intelligent control LED integrated light source Check prices <https://pricing.snapeda.com/parts/WS2812C-2020/Worldsemi/view-part?ref=eda>; AVAILABILITY: Not in stock; DESCRIPTION: Intelligent control LED integrated light source; MF: Worldsemi; MP: WS2812C-2020; PACKAGE: Package; PRICE: None
U28 = ESP32-WROOM-32U:ESP32-WROOM-32U: Wi-Fi/BT BLE Module ESP32-D0WD SPI Flash UART U.FL Conn. Check prices <https://pricing.snapeda.com/parts/ESP32-WROOM-32U/Espressif%20Systems/view-part?ref=eda>; AVAILABILITY: In Stock; DESCRIPTION: Bluetooth, WiFi 802.11b/g/n, Bluetooth v4.2 +EDR, Class 1, 2 and 3 Transceiver Module 2.4GHz ~ 2.5GHz Antenna Not Included, U.FL Surface Mount; MF: Espressif Systems; MP: ESP32-WROOM-32U; PACKAGE: Module Espressif Systems; PRICE: None; PURCHASE-URL: https://pricing.snapeda.com/search/part/ESP32-WROOM-32U/?ref=eda
U$1 = Magister-Libraries:PCF2129AT
U$2 = batt holder:HOLDER
VR1 = SparkFun-Resistors:TRIMPOT: Trimming Potentiometer (Trimpot) Three-terminal potentiometers, with an adjustable wiper and two adjustable resistors. A pot can be used to create a configurable voltage divider, or as a variable resistor. "Trimpots" are a subset of potentiometers, usually intended for "set-and-forget" applications. They're often more delicate than standard potentiometers - rated for fewer turns. Variants PTH-KNOB - PTH Trimpot w/ finger-adjustable knob Trimpot 10K with Knob <https://www.sparkfun.com/products/9806> (COM-09806) Datasheet <http://www.sparkfun.com/datasheets/Components/General/TSR-3386.pdf> SMD-3MM-CLOSED-FRAME - SMD 3mm Square Closed-Frame Trimpot Used on e.g. EasyDriver - Stepper Motor Driver <https://www.sparkfun.com/products/12779> Datasheet <http://www.bitechnologies.com/pdfs/22.pdf> (22AR10KTR) SMD-5MM - SMD 5mm Square Closed-Frame Trimpot Used on e.g. IOIO-OTG - V2.2 <https://www.sparkfun.com/products/13613> Datasheet <http://www.vishay.com/docs/51008/ts53.pdf> (TS53YL502MR10) SMD-3MM-1/10W-25% - 3mm Square Open-Frame Trimpot Used on e.g. SparkFun Shapeoko <https://www.sparkfun.com/products/13899> Datasheet <http://www.bourns.com/docs/Product-Datasheets/TC33.pdf> (TC33X-2-103E); PROD_ID: RES-09285; VALUE: 10k

## Net classes
1 HV: width 0.35 mm, drill 0.35 mm, clearance 0.3 mm